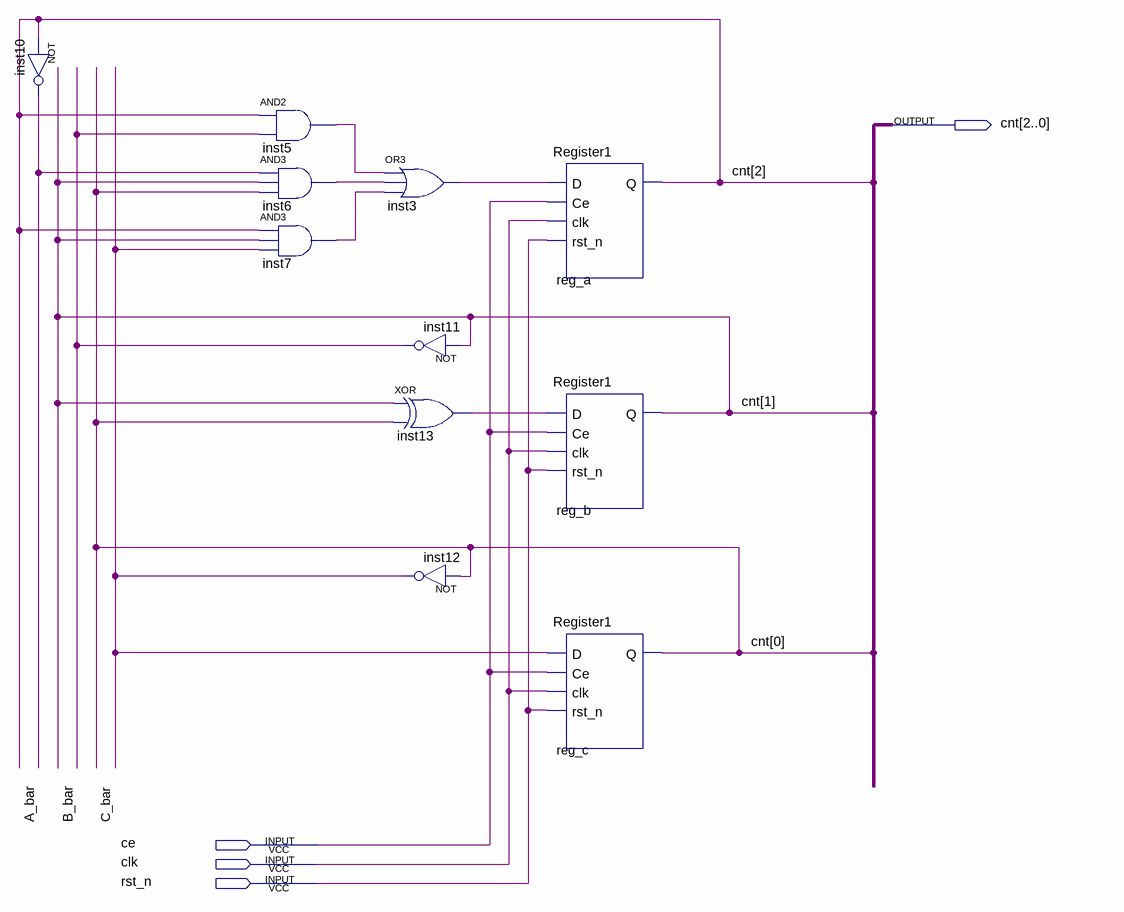
[diagram p0: schematic sheet]
// Quartus schematic count_8.bdf as structural Verilog: 11 symbols, 4 pins
module count_8 (
  input  ce,
  input  clk,
  input  rst_n,
  output [2:0] cnt
);

  wire A_bar, B_bar, C_bar, inst3_out, inst5_out, inst6_out, inst7_out, inst13_out;

  not inst10 (A_bar, cnt[2]);
  and inst5 (inst5_out, cnt[2], B_bar);
  and inst6 (inst6_out, A_bar, cnt[1], cnt[0]);
  and inst7 (inst7_out, cnt[2], cnt[1], C_bar);
  or inst3 (inst3_out, inst5_out, inst6_out, inst7_out);
  not inst11 (B_bar, cnt[1]);
  xor inst13 (inst13_out, cnt[1], cnt[0]);
  not inst12 (C_bar, cnt[0]);
  Register1 reg_a (.D(inst3_out), .Ce(ce), .clk(clk), .rst_n(rst_n), .Q(cnt[2]));
  Register1 reg_b (.D(inst13_out), .Ce(ce), .clk(clk), .rst_n(rst_n), .Q(cnt[1]));
  Register1 reg_c (.D(C_bar), .Ce(ce), .clk(clk), .rst_n(rst_n), .Q(cnt[0]));
endmodule
